# EAGLE design Ham-Dip-V2-004 (EAGLE 8.2.1)
VCC: 5v
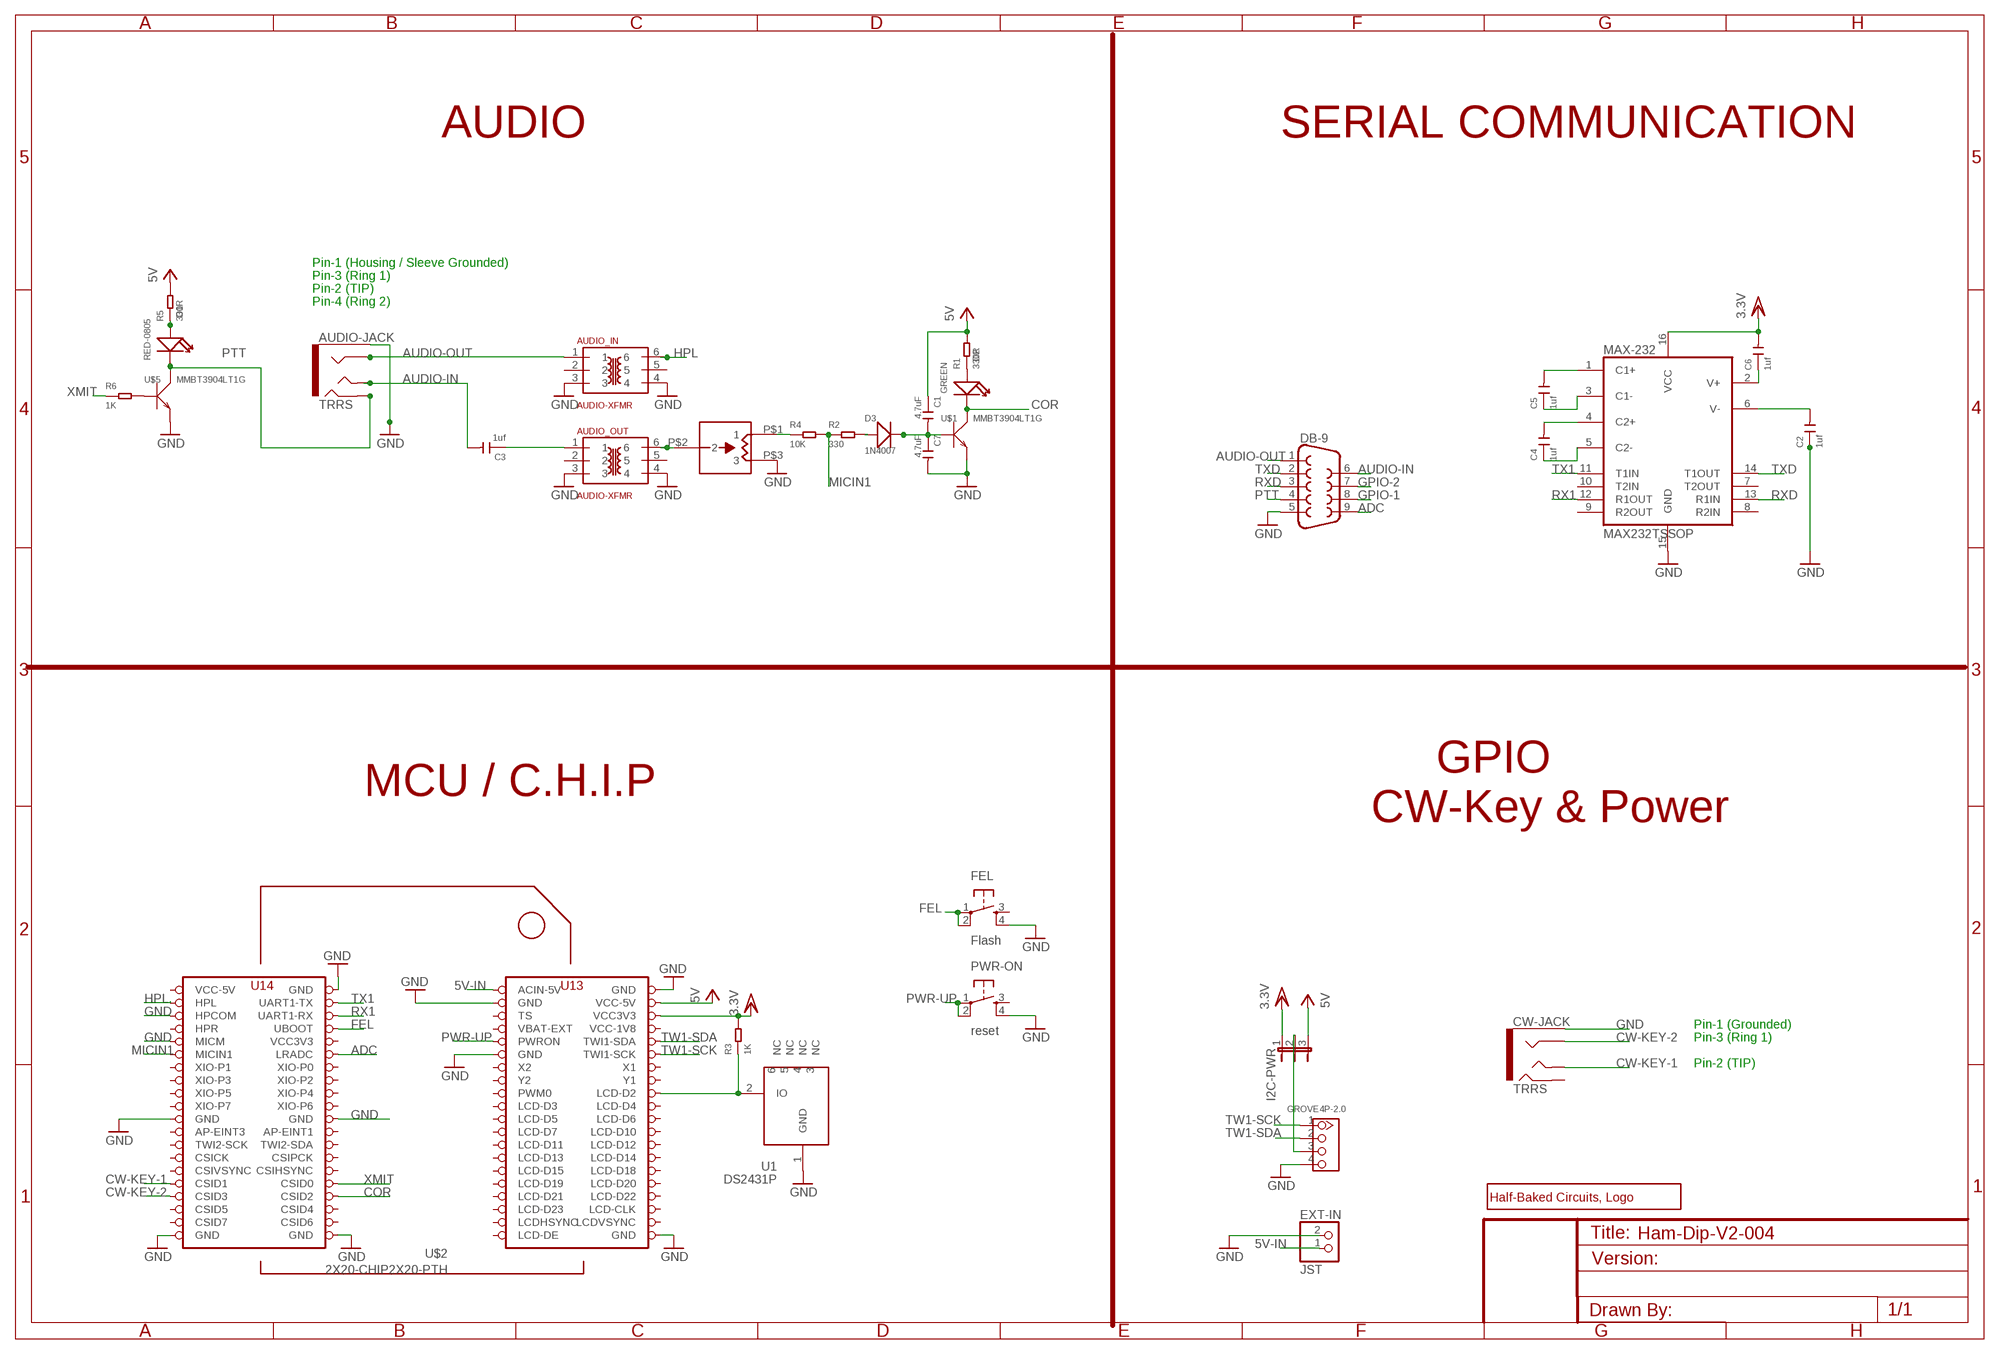
[diagram p0: schematic, sheet 1]

## Parts
AUDIO-JACK  TRRS  AUDIO-JACK3  [AUDIO-JACK-TRRS-SMD]
AUDIO_IN  AUDIO-XFMR  SM-LP-5001  [SM-LP-5001]
AUDIO_OUT  AUDIO-XFMR  SM-LP-5001  [SM-LP-5001]
C1  4.7uF  CERAMIC-1UF-25V-10%-X7R(0805)  [C0805]
C2  1uf  CERAMIC-1UF-25V-10%-X7R(0805)  [C0805]
C3  1uf  CERAMIC-1UF-25V-10%-X7R(0805)  [C0805]
C4  1uf  CERAMIC-1UF-25V-10%-X7R(0805)  [C0805]
C5  1uf  CERAMIC-1UF-25V-10%-X7R(0805)  [C0805]
C6  1uf  CERAMIC-1UF-25V-10%-X7R(0805)  [C0805]
C7  4.7uF  CERAMIC-1UF-25V-10%-X7R(0805)  [C0805]
CW-JACK  TRRS  AUDIO-JACK3  [AUDIO-JACK-TRRS-SMD]
D1  RED-0805  SMD-LED-CLEAR-RED(0805)  [LED-0805]
D2  GREEN  SMD-LED-CLEAR-RED(0805)  [LED-0805]
D3  1N4007  DIODE-GEN-PURPOSE-1KV-1A(DO-214AC)  [DO-214AC]
DB-9  DB9FEMALE  [DB9]
EXT-IN  JST  JST_2PIN-THM  [JST-PH-2-THM]
FEL  Flash  TAC_SWITCHSMD  [TACTILE_SWITCH_SMD]
GROVE  4P-2.0  GROVE-CONNECTOR-DIP(4P-2.0)  [HW4-2.0]
I2C-PWR  JP2E  [JP2]
MAX-232  MAX232TSSOP  [TSSOP16]
MIC-LVL  1K  TC33X  [TC33X]
PWR-ON  reset  TAC_SWITCHSMD  [TACTILE_SWITCH_SMD]
R1  330R  SMD-RES-220R-5%-1/8W(0805)  [R0805]
R2  330  SMD-RES-220R-5%-1/8W(0805)  [R0805]
R3  1K  SMD-RES-220R-5%-1/8W(0805)  [R0805]
R4  10K  SMD-RES-10K-1%-1/8W(0805)  [R0805]
R5  330R  SMD-RES-220R-5%-1/8W(0805)  [R0805]
R6  1K  SMD-RES-220R-5%-1/8W(0805)  [R0805]
U1  DS2431P  [TSOC6]
U$1  MMBT3904LT1G  SMD-TRANSISTORS-NPN-40V-200MA-MMBT3904LT1G(SOT-23)  [SOT-23]
U$2  2X20-CHIP2X20-PTH  2X20-CHIP2X20-PTH-CHIP_A  [2X20CHIP-TH]
U$4  HAM-DIP  [HAM-DIP]
U$5  MMBT3904LT1G  SMD-TRANSISTORS-NPN-40V-200MA-MMBT3904LT1G(SOT-23)  [SOT-23]

## Nets
5V-IN: EXT-IN.1 U$2.CHG-IN(ACIN-5V)
ADC: DB-9.9 U$2.LRADC
AUDIO-IN: AUDIO-JACK.TIP C3.2 DB-9.6
AUDIO-OUT: AUDIO-JACK.RING1 AUDIO_IN.1 DB-9.1
COR: D2.- U$1.3(C) U$2.CSID2
CW-KEY-1: CW-JACK.TIP U$2.CSID1
CW-KEY-2: CW-JACK.RING1 U$2.CSID3
FEL: FEL.1 FEL.2 U$2.FEL(UBOOT)
GND: AUDIO-JACK.EARTH AUDIO_IN.3 AUDIO_IN.4 AUDIO_OUT.3 AUDIO_OUT.4 C2.1 C7.2 CW-JACK.EARTH DB-9.5 EXT-IN.2 FEL.4 GROVE.4 MAX-232.15(GND) MIC-LVL.P$3 PWR-ON.4 U1.1(GND) U$1.2(E) U$2.GND@1(GND) U$2.GND@2(GND) U$2.GND@3(GND) U$2.GND@4(GND) U$2.GND@5(GND) U$2.GND@6(GND) U$2.GND@7(GND) U$2.GND@8(GND) U$2.GND@10(GND) U$2.HPCOM U$2.MICM U$5.2(E)
GPIO-1: DB-9.8
GPIO-2: DB-9.7
HPL: AUDIO_IN.6 U$2.HPL
IN: AUDIO_OUT.1 C3.1
MICIN1: R2.1 R4.2 U$2.MICIN1
N$1: D1.+ R5.1
N$3: MIC-LVL.P$1 R4.1
N$4: AUDIO_OUT.6 MIC-LVL.P$2
N$5: GROVE.3 I2C-PWR.2
N$6: C6.1 MAX-232.2(V+)
N$7: R3.1 U1.2(IO) U$2.LCD-D2
N$8: R6.2 U$5.1(B)
N$9: D2.+ R1.1
N$10: C1.2 C7.1 D3.2(-) U$1.1(B)
N$11: C2.2 MAX-232.6(V-)
N$12: D3.1(+) R2.2
N$16: C5.2 MAX-232.1(C1+)
N$17: C4.2 MAX-232.4(C2+)
N$18: C5.1 MAX-232.3(C1-)
N$19: C4.1 MAX-232.5(C2-)
PTT: AUDIO-JACK.RING2 D1.- DB-9.4 U$5.3(C)
PWR-UP: PWR-ON.1 PWR-ON.2 U$2.PWRON
RX1: MAX-232.12(R1OUT) U$2.UART1-RX
RXD: DB-9.3 MAX-232.13(R1IN)
TW1-SCK: GROVE.1 U$2.TWI1-SCK
TW1-SDA: GROVE.2 U$2.TWI1-SDA
TX1: MAX-232.11(T1IN) U$2.UART1-TX
TXD: DB-9.2 MAX-232.14(T1OUT)
VCC: C1.1 I2C-PWR.3 R1.2 R5.2 U$2.VCC5V@0(VCC-5V) ; supply symbol labelled 5V
VCC/2: C6.2 I2C-PWR.1 MAX-232.16(VCC) R3.2 U$2.VCC3V3 ; supply symbol labelled 3.3V
XMIT: R6.1 U$2.CSID0
Unconnected: AUDIO_IN.2 AUDIO_IN.5 AUDIO_OUT.2 AUDIO_OUT.5 CW-JACK.RING2 FEL.3 MAX-232.7(T2OUT) MAX-232.8(R2IN) MAX-232.9(R2OUT) MAX-232.10(T2IN) PWR-ON.3 U1.3(NC) U1.4(NC) U1.5(NC) U1.6(NC) U$2.AP-EINT1 U$2.AP-EINT3 U$2.BAT(VBAT-EXT) U$2.CSICK U$2.CSID4 U$2.CSID5 U$2.CSID6 U$2.CSID7 U$2.CSIHSYNC U$2.CSIPCK U$2.CSIVSYNC U$2.HPR U$2.LCD-CLK U$2.LCD-D3 U$2.LCD-D4 U$2.LCD-D5 U$2.LCD-D6 U$2.LCD-D7 U$2.LCD-D10 U$2.LCD-D11 U$2.LCD-D12 U$2.LCD-D13 U$2.LCD-D14 U$2.LCD-D15 U$2.LCD-D18 U$2.LCD-D19 U$2.LCD-D20 U$2.LCD-D21 U$2.LCD-D22 U$2.LCD-D23 U$2.LCD-DE U$2.LCD-HSYNC(LCDHSYNC) U$2.LCD-VSYNC(LCDVSYNC) U$2.PWM0 U$2.TS U$2.TWI2-SCK U$2.TWI2-SDA U$2.X1 U$2.X2 U$2.XIO-P0 U$2.XIO-P1 U$2.XIO-P2 U$2.XIO-P3 U$2.XIO-P4 U$2.XIO-P5 U$2.XIO-P6 U$2.XIO-P7 U$2.Y1 U$2.Y2

## Notes on the sheet
- AUDIO | SERIAL COMMUNICATION
- Pin-1 (Housing / Sleeve Grounded)
- Pin-3 (Ring 1)
- Pin-2 (TIP)
- Pin-4 (Ring 2)
- MCU / C.H.I.P
- GPIO
  CW-Key & Power
- Pin-1 (Grounded)
- Pin-3 (Ring 1)
- Pin-2 (TIP)

## Power pins joined to a net without a drawn wire
VCC3V3: U$2.VCC3V3@1(VCC3V3)
VCC-1V8: U$2.VCC1V8(VCC-1V8)
VCC-5V: U$2.VCC5V@1(VCC-5V)

## Library data of the parts
AUDIO-JACK CW-JACK = SparkFun-Connectors:AUDIO-JACK3: Audio jack - 3.5mm TRRS variety - two rings.
AUDIO_IN AUDIO_OUT = HalfBakedCircuits:SM-LP-5001
C1 C7 = Seeed-Capacitor-2016:CERAMIC-1UF-25V-10%-X7R(0805): 302010179; MPN: CC0805KKX7R8BB105; VALUE: 1uf
C2-C6 = Seeed-Capacitor-2016:CERAMIC-1UF-25V-10%-X7R(0805): 302010179; MPN: CC0805KKX7R8BB105
D1 = Seeed-LED-2016:SMD-LED-CLEAR-RED(0805): 304090046; MPN: 17-215SURC/S530-A2/TR8
D2 = Seeed-LED-2016:SMD-LED-CLEAR-RED(0805): 304090046; MPN: 17-215SURC/S530-A2/TR8; VALUE: RED-0805
D3 = Seeed-Diode:DIODE-GEN-PURPOSE-1KV-1A(DO-214AC): 304010013; MPN: 1N4007
DB-9 = SparkFun-Connectors:DB9: DB9 Connector Standard DB9 (D-Sub 9) serial connector. Can be used for CAN bus as well as RS485 and RS232. Footprint production proven. Here is the female version connector we sell at SparkFun: 9 Pin Female Serial Connector - PCB Mount <https://www.sparkfun.com/products/429> (PRT-00429) This connector has been used on the following SparkFun products: SparkFun RS232 Shifter - SMD <https://www.sparkfun.com/products/449> (PRT-00449) SparkFun RS232 Shifter SMD (No DB9) <https://www.sparkfun.com/products/8780> (PRT-08780); PROD_ID: CONN-08194
EXT-IN = adafruit:JST_2PIN: JST 2-Pin Connectors of various flavors SMT-RA (S2B-PH-SM4) 4UConnector #17311 SMT (B2B-PH-SM4) THM-RA (S2B-PH) THM (B2B-PH)
FEL PWR-ON = SparkFun-Electromechanical:TAC_SWITCH: Momentary Switch Button commonly used for reset or general input. Spark Fun Electronics SKU : COM-00097 SMT- SWCH-08247; PROD_ID: SWCH-08247
GROVE = Seeed-Connector -2016:GROVE-CONNECTOR-DIP(4P-2.0): 320110033
I2C-PWR = jumper:JP2E: JUMPER
MAX-232 = SparkFun-DigitalIC:MAX232: RS232 Transceiver Very common IC. This is generically called 'MAX232', but works with the 3V equivalent MAX3232 generic ICs. Field tested and mother approved. Spark Fun Electronics SKU : COM-00316 (DIP) and COM-00589 (SMD)
MIC-LVL = HalfBakedCircuits:TC33X
R1-R3 R5 R6 = Seeed-Resistor-2016:SMD-RES-220R-5%-1/8W(0805): 301010315; MPN: RC0805JR-07220RL; VALUE: 220R
R4 = Seeed-Resistor-2016:SMD-RES-10K-1%-1/8W(0805): 301010361; MPN: RC0805FR-0710KL
U1 = JKW_CHIP:DS2431: 1024-Bit EEPROM This chip provides a 4x256 Bit EEPROM, which can be programmed@5V. Write protection and OTP emulation are available, too. Author: Jan Kandziora <jjj@gmx.de>; DESCRIPTION: IC, 1024-Bit, 1-Wire EEPROM, TSOC6; FOOTPRINT: TSOC6; LINK: http://www.digikey.com/product-detail/en/DS2431P%2BT%26R/DS2431P%2BT%26RCT-ND/3647900; MFG: DIGIKEY; MFG_PN: DS2431P+T&RCT-ND; PART_TYPE: IC; PRICE: 0.98; VENDOR: MAXIM; VENDOR_PART_NUMBER: DS2431P+T&R
U$1 U$5 = Seeed-Transistor-2016:SMD-TRANSISTORS-NPN-40V-200MA-MMBT3904LT1G(SOT-23): 305010013; MPN: MMBT3904LT1G
U$2 = JKW_CHIP:2X20-CHIP: Chip header; DESCRIPTION: 2x20 .100" headers; FOOTPRINT: 2x20 .100" CHIP foot print; VENDOR: ASSMANN; VENDOR_PART_NUMBER: AWHW40-G-SMD-R (single)
U$4 = HalfBakedCircuits:HAM-DIP

## Board
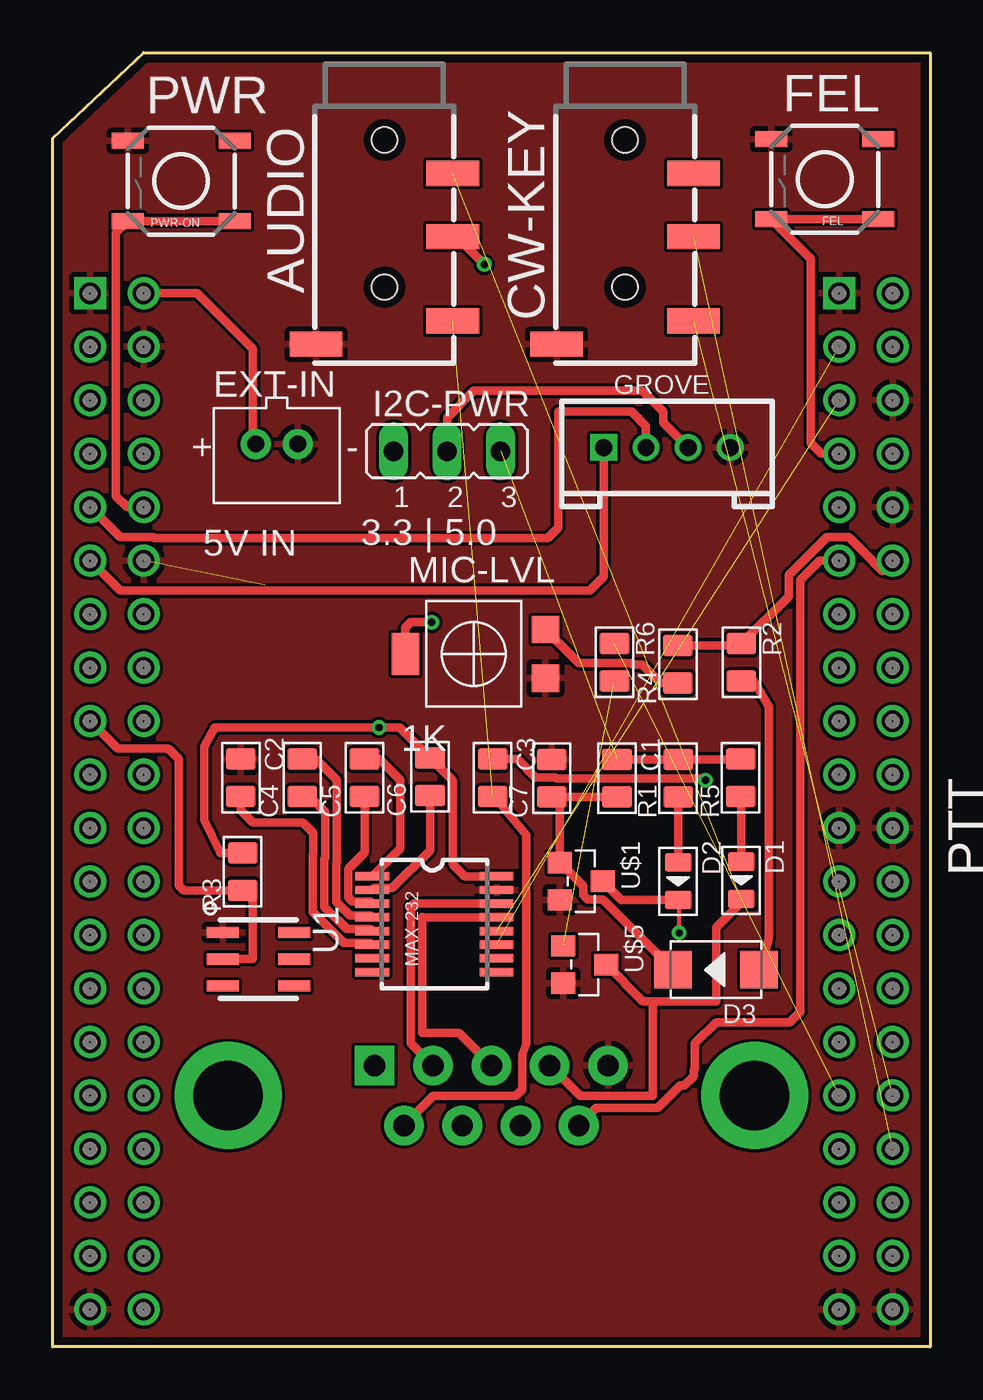
[diagram p1: board, top side]
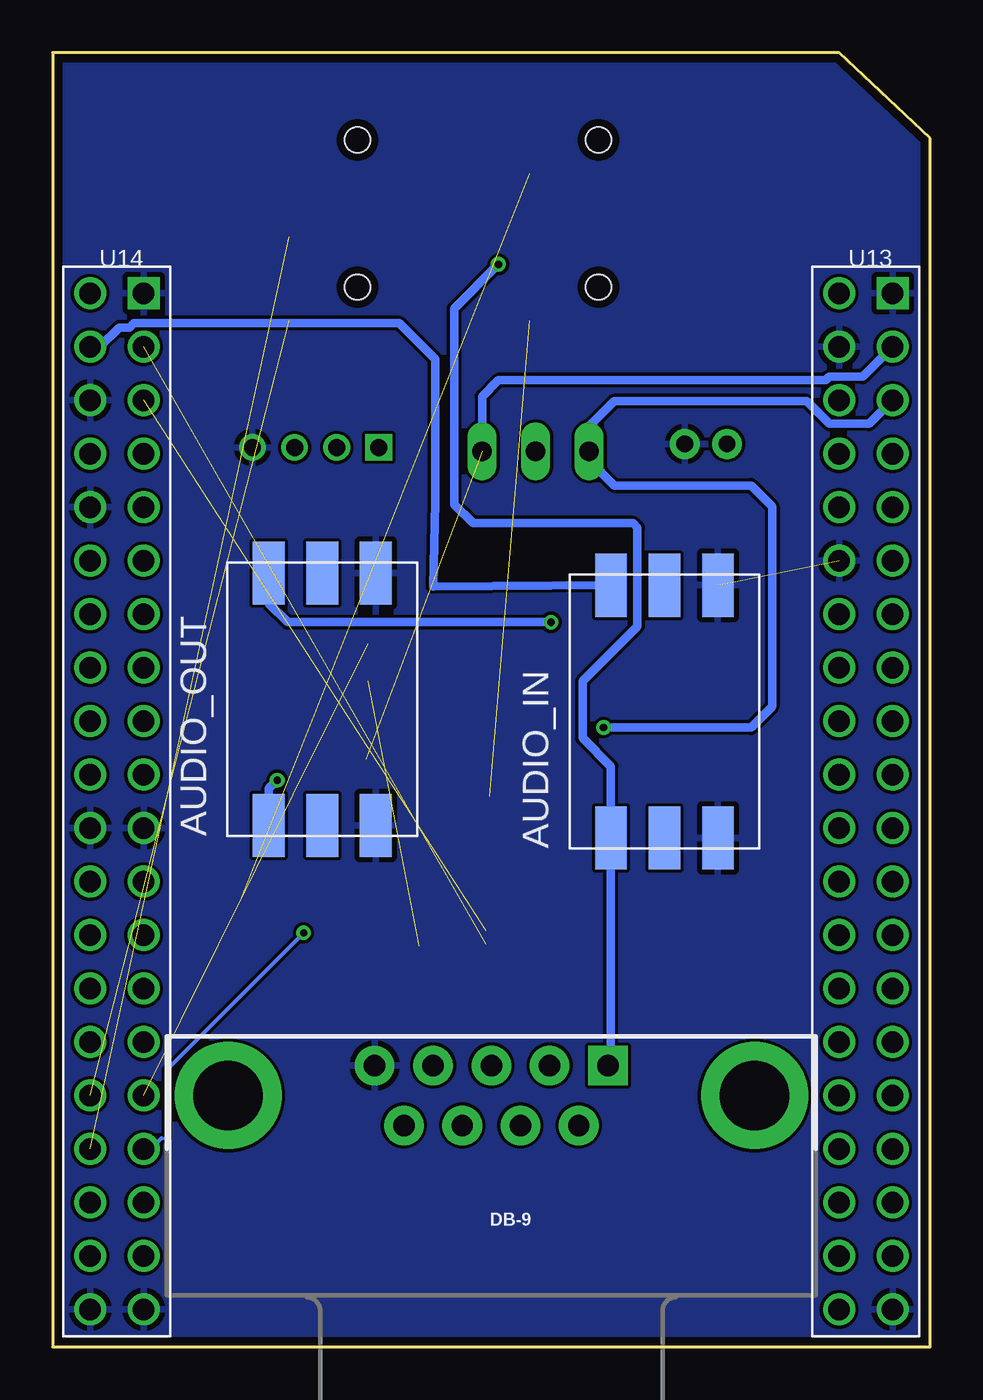
[diagram p2: board, bottom side, seen from below]

Size 41.66 x 61.47 mm. Coordinates in mm from the lower left corner, seen from the top.
Outline: 0,0 0,57.4 4.32,61.47 41.66,61.47 41.66,0 0,0
Copper layers (1*16): Top 0.0356mm / dielectric 1.5011mm / Bottom 0.0356mm
Design rules "oshpark-2layer": minimum track width 6mil, minimum drill 13mil, track to track 6mil, track to pad 6mil, pad to pad 6mil, via to via 6mil, smd to smd 6mil, copper to edge 15mil, drill to drill 6mil, minimum pad ring 7mil, minimum via ring 7mil, stop-mask expansion 2.5mil, vias tented up to drill 0mil, thermal gap 10mil

### Footprints (pad centres in the part's own frame; a part is rotated, then mirrored left to right if it is on the bottom)
AUDIO-JACK-TRRS-SMD = smd 1.2 x 2.5: EARTH 11.3,-3.25; RING1 6.2,3.25; RING2 3.2,3.25; TIP 10.2,3.25 | hole 1.2: 1.6,0; 8.6,0
SM-LP-5001 = smd 3 x 1.5: 1 -6,2.54; 2 -6,0; 3 -6,-2.54; 4 6,-2.54; 5 6,0; 6 6,2.54
C0805 = smd 1.397 x 1.016: 1 0,0.889; 2 0,-0.889
LED-0805 = smd 0.889 x 1.27: + -0.889,0; - 0.889,0
DO-214AC = smd 1.8 x 1.77: 1 -2.042,0; 2 2.042,0
DB9 = drill 1.016 pad 1.88 square: 1 -5.54,-1.42 | drill 1.016 pad 1.88: 2 -2.77,-1.42; 3 0,-1.42; 4 2.77,-1.42; 5 5.54,-1.42; 6 -4.15,1.42; 7 -1.38,1.42; 8 1.38,1.42; 9 4.15,1.42 | drill 3.302 pad 5.08: G1 -12.5,0; G2 12.5,0
JST-PH-2-THM = drill 0.8 pad 1.422: 1 1,0; 2 -1,0
TACTILE_SWITCH_SMD = smd 1.524 x 0.762: 1 -2.54,1.905; 2 2.54,1.905; 3 -2.54,-1.905; 4 2.54,-1.905
HW4-2.0 = drill 0.8 pad 1.27 square: 1 -3,0 | drill 0.8 pad 1.27: 2 -1,0; 3 1,0; 4 3,0
JP2 = drill 0.914 long: 1 -2.54,0; 2 0,0; 3 2.54,0
TSSOP16 = smd 0.4 x 1.6: 1 -2.225,-2.85; 2 -1.575,-2.85; 3 -0.925,-2.85; 4 -0.275,-2.85; 5 0.375,-2.85; 6 1.025,-2.85; 7 1.675,-2.85; 8 2.325,-2.85; 9 2.325,3.05; 10 1.675,3.05; 11 1.025,3.05; 12 0.375,3.05; 13 -0.275,3.05; 14 -0.925,3.05; 15 -1.575,3.05; 16 -2.225,3.05
TC33X = smd 1.3 x 1.3: P$1 -1.155,3.4; P$3 1.155,3.4 | smd 2 x 1.3: P$2 0,-3.25
R0805 = smd 1.397 x 1.016: 1 0,0.889; 2 0,-0.889
TSOC6 = smd 0.53 x 1.53: 1 -1.27,-1.7; 2 0,-1.7; 3 1.27,-1.7; 4 1.27,1.7; 5 0,1.7; 6 -1.27,1.7
SOT-23 = smd 1.016 x 1.143: 1 -0.889,-1.016; 2 0.889,-1.016; 3 0,1.016
2X20CHIP-TH = drill 1.016: AP-EINT1 36.83,21.59; AP-EINT3 39.37,21.59; BAT 3.81,41.91; CHG-IN 3.81,49.53; CSICK 39.37,16.51; CSID0 36.83,11.43; CSID1 39.37,11.43; CSID2 36.83,8.89; CSID3 39.37,8.89; CSID4 36.83,6.35; CSID5 39.37,6.35; CSID6 36.83,3.81; CSID7 39.37,3.81; CSIHSYNC 36.83,13.97; CSIPCK 36.83,16.51; CSIVSYNC 39.37,13.97; FEL 36.83,41.91; GND@1 3.81,36.83; GND@2 1.27,1.27; GND@4 39.37,24.13; GND@5 39.37,1.27; GND@6 36.83,1.27; GND@7 36.83,24.13; GND@10 3.81,46.99; HPCOM 39.37,44.45; HPL 39.37,46.99; HPR 39.37,41.91; LCD-CLK 1.27,6.35; LCD-D2 1.27,29.21; LCD-D3 3.81,26.67; LCD-D4 1.27,26.67; LCD-D5 3.81,24.13; LCD-D6 1.27,24.13; LCD-D7 3.81,21.59; LCD-D10 1.27,21.59; LCD-D11 3.81,19.05; LCD-D12 1.27,19.05; LCD-D13 3.81,16.51; LCD-D14 1.27,16.51; LCD-D15 3.81,13.97; LCD-D18 1.27,13.97; LCD-D19 3.81,11.43; LCD-D20 1.27,11.43; LCD-D21 3.81,8.89; LCD-D22 1.27,8.89; LCD-D23 3.81,6.35; LCD-DE 3.81,1.27; LCD-HSYNC 3.81,3.81; LCD-VSYNC 1.27,3.81; LRADC 36.83,36.83; MICIN1 39.37,36.83; MICM 39.37,39.37; PWM0 3.81,29.21; PWRON 3.81,39.37; TS 3.81,44.45; TWI1-SCK 1.27,36.83; TWI1-SDA 1.27,39.37; TWI2-SCK 39.37,19.05; TWI2-SDA 36.83,19.05; UART1-RX 36.83,44.45; UART1-TX 36.83,46.99; VCC1V8 1.27,41.91; VCC3V3 1.27,44.45; VCC3V3@1 36.83,39.37; VCC5V@0 1.27,46.99; VCC5V@1 39.37,49.53; X1 1.27,34.29; X2 3.81,34.29; XIO-P0 36.83,34.29; XIO-P1 39.37,34.29; XIO-P2 36.83,31.75; XIO-P3 39.37,31.75; XIO-P4 36.83,29.21; XIO-P5 39.37,29.21; XIO-P6 36.83,26.67; XIO-P7 39.37,26.67; Y1 1.27,31.75; Y2 3.81,31.75 | drill 1.016 square: GND@3 1.27,49.53; GND@8 36.83,49.53

### Placement (x,y rotation side)
AUDIO-JACK  15.75,58.93 270 top
AUDIO_IN  12.61,30.17 90 bottom
AUDIO_OUT  28.86,30.76 90 bottom
C1  26.8,27.01 0 top
C2  8.94,27.03 0 top
C3  20.89,27.02 0 top
C4  11.85,27.02 180 top
C5  14.81,27.02 180 top
C6  17.92,27.08 180 top
C7  23.7,27.01 180 top
CW-JACK  27.18,58.93 270 top
D1  32.69,22.15 270 top
D2  29.7,22.11 270 top
D3  31.5,17.91 180 top
DB-9  20.83,11.94 180 bottom
EXT-IN  10.64,42.89 180 top
FEL  36.66,55.46 180 top
GROVE  29.17,42.72 0 top
I2C-PWR  18.73,42.53 0 top
MAX-232  18.03,20.13 270 top
MIC-LVL  20,32.91 270 top
PWR-ON  6.1,55.37 180 top
R1  29.7,27.01 180 top
R2  32.7,32.51 0 top
R3  9.02,22.57 180 top
R4  29.69,32.42 180 top
R5  32.67,27.03 180 top
R6  26.67,32.51 0 top
U1  9.77,18.41 270 top
U$1  25.1,22.11 270 top
U$2  0.51,0.51 0 top
U$4  44.5,53.41 0 top
U$5  25.26,18.15 270 top

### Tracks (layer width: path | path; a pad name or v marks a point on that pad's centre or on a via)
5V-IN
  Top 0.406: U$2.CHG-IN 6.87,50.04 9.5,47.41 9.5,43.03 EXT-IN.1
ADC
  Top 0.406: DB-9.9 25.82,11.35 28.73,11.35 29.79,12.41 30,12.41 30.43,12.85 30.43,13.14 30.5,13.2 30.5,14.41 31.5,15.41 35,15.41 35.5,15.91 35.5,36.41 36.42,37.34 U$2.LRADC
AUDIO-IN  (1 unrouted)
  Top 0.406: DB-9.6 18.07,11.91 22,11.91 22.3,12.22 22.3,13.89 22.5,14.39 22.5,24.31 20.97,26.13 C3.2
AUDIO-OUT  (via drill 0.35)
  Top 0.406: AUDIO-JACK.RING1 19.18,52.73 v20.5,51.41
  Bottom 0.406: DB-9.1 15.15,13.5 AUDIO_IN.1 15.15,27.57 16.5,28.91 16.5,31.61 13.9,34.21 13.9,38.91 14.1,39.11 21.7,39.11 22.6,40.01 22.6,49.31 v20.5,51.41
COR  (via drill 0.33)
  Top 0.152: 29.75,21.16 D2.-
  Top 0.2: v29.75,19.66 29.75,21.16
  Top 0.406: U$1.3 27,21.22 D2.-
  Bottom 0.152: 36.5,9.91 36.25,9.91 | 37,9.41 37.25,9.41 U$2.CSID2
  Bottom 0.2: v29.75,19.66 36.25,13.16 36.25,9.91 | 37,9.41 36.5,9.91
CW-KEY-1  (1 unrouted)
CW-KEY-2  (1 unrouted)
FEL
  Top 0.406: FEL.1 FEL.2 36,51.68 36,42.91 36.49,42.42 U$2.FEL
GND  (1 unrouted)
  pour Bottom: -2.03,61.47 42.59,61.47 42.42,-0.76 -2.03,-0.76
  pour Top: -4.57,61.47 41.15,61.47 41.15,-2.03 -4.57,-2.03
HPL
  Bottom 0.406: AUDIO_IN.6 23.59,36.11 23.5,40.11 23.5,46.91 25.2,48.62 37.8,48.62 38,48.41 38.5,48.41 39.41,47.5 U$2.HPL
IN  (via drill 0.35)
  Top 0.406: C3.1 22.05,27.91 22.92,27.04 23.87,27.04 23.92,26.99 30.92,26.99 v31,26.91
  Bottom 0.406: AUDIO_OUT.1 31.4,26.51 v31,26.91
MICIN1
  Top 0.406: U$2.MICIN1 39.4,36.86 38.46,37.8 37.8,38.46 36.75,38.46 34.94,36.64 34.94,35.64 R2.1 32.61,33.31 R4.2
N$1
  Top 0.406: R5.1 32.69,26.12 D1.+
N$3
  Top 0.406: MIC-LVL.P$1 24.98,32.48 27.44,32.48 27.51,32.41 28,32.41 28.87,31.54 R4.1
N$4  (via drill 0.35)
  Top 0.406: MIC-LVL.P$2 16.75,34.16 17,34.41 v18,34.41
  Bottom 0.406: AUDIO_OUT.6 31.4,35.31 30.5,34.41 v18,34.41
N$5
  Top 0.406: I2C-PWR.2 18.73,44.15 20,45.41 28,45.41 29,44.41 29,43.89 GROVE.3
N$6
  Top 0.406: MAX-232.2 15.27,21.8 16.13,21.8 17.92,23.59 C6.1
N$7
  Top 0.406: U$2.LCD-D2 3.08,28.41 5.5,28.41 6,27.91 6,21.91 6.23,21.68 R3.1 9.5,21.21 9.5,18.41 9.49,18.41 U1.2
N$8  (1 unrouted)
N$9
  Top 0.406: D2.+ R1.1
N$10
  Top 0.406: D3.2 26.12,21.25 25.39,21.25 25.18,21.46 25.18,21.9 U$1.1 | U$1.1 23.8,23.29 | C1.2 C7.1 24.08,25.74 U$1.1
N$11
  Top 0.406: MAX-232.6 15.09,19.19 13.81,19.19 12.35,20.66 12.35,23.39 12.38,23.43 12.38,24.41 11.88,24.91 9.5,24.91 8.94,25.47 C2.2
N$12
  Top 0.406: D3.1 34,19.37 34,30.41 33.28,31.62 R2.2
N$16
  Top 0.406: MAX-232.1 16.5,23.67 16.5,26.91 15.5,27.91 C5.2
N$17
  Top 0.406: MAX-232.4 15.09,20.49 14.09,20.49 13.46,21.12 13.46,22.93 13.5,22.96 13.5,26.91 12.5,27.91 C4.2
N$18
  Top 0.406: MAX-232.3 15.09,21.14 14.23,21.14 14.02,21.36 14.02,22.7 14.81,23.48 C5.1
N$19
  Top 0.406: MAX-232.5 15.09,19.84 13.95,19.84 12.91,20.89 12.91,23.16 12.94,23.19 12.94,25.41 12.22,26.13 C4.1
PTT  (1 unrouted)
  Top 0.406: U$5.3 28.01,16.41 28.5,16.41 | 28.5,16.41 31.5,16.41 31.5,19.91 32.69,21.11 D1.- | DB-9.4 25.04,11.91 28.5,11.91 28.5,16.41
PWR-UP
  Top 0.406: PWR-ON.1 PWR-ON.2 3,52.91 3,40.41 3.53,39.88 U$2.PWRON
RX1  (1 unrouted)
RXD
  Top 0.406: DB-9.3 19.27,14.91 17.55,14.91 17.55,20.41 17.57,20.4 MAX-232.13
TW1-SCK
  Top 0.406: U$2.TWI1-SCK 3.2,35.92 4.78,35.92 4.78,35.91 25.5,35.91 26.17,36.59 GROVE.1
TW1-SDA
  Top 0.406: U$2.TWI1-SDA 3.2,38.46 4.78,38.46 4.82,38.41 23.5,38.41 24,38.91 24,44.41 27.5,44.41 28.17,43.74 GROVE.2
TX1  (1 unrouted)
TXD
  Top 0.406: DB-9.2 17,14.42 17,20.91 17.13,21.05 MAX-232.14
VCC  (1 unrouted)
  Top 0.406: R5.2 32.65,27.9 R1.2 C1.1
  Bottom 0.406: U$2.VCC5V@0 3.2,46.08 4.78,46.08 4.94,45.91 20.5,45.91 21.27,45.14 I2C-PWR.3
VCC/2  (via drill 0.35)
  Top 0.406: MAX-232.16 19.56,22.35 19,22.91 19,26.89 C6.2 16.47,29.41 v15.5,29.41 7.7,29.41 7.2,28.51 7.2,25.01 7.95,23.46 R3.2
  Bottom 0.406: U$2.VCC3V3 2.9,43.84 4.78,43.84 5.85,44.91 15,44.91 16.19,43.72 I2C-PWR.1 16.19,42.11 15,40.91 8.5,40.91 7.5,39.91 7.5,30.41 8.5,29.41 v15.5,29.41
XMIT  (1 unrouted)

### Text on the board
tPlace: PWR | FEL | AUDIO | CW-KEY | 5V IN | 3.3 | 5.0 | PTT
_bsilk: HAM-DIP | REV: B | By: N4LDR / WD4VA / 7/15/2017 | 1 - AUDIO OUT 6 - AUDIO IN / 2 - TX 7 - GPIO 2 / 3 - RX 8 - GPIO 1 / 4 - PTT 9 - ANALOG IN / 5 - GND